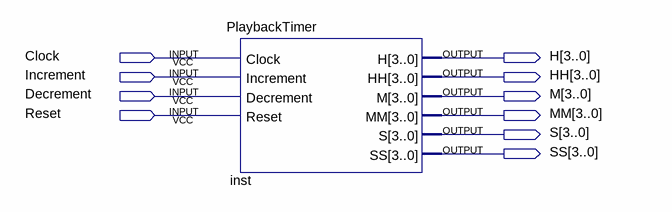
[diagram p0: schematic sheet]
// Quartus schematic partAtest.bdf as structural Verilog: 1 symbols, 10 pins
module partAtest (
  input  Clock,
  input  Increment,
  input  Decrement,
  input  Reset,
  output [3:0] H,
  output [3:0] HH,
  output [3:0] M,
  output [3:0] MM,
  output [3:0] S,
  output [3:0] SS
);

  PlaybackTimer inst (
    .Clock(Clock), .Increment(Increment), .Decrement(Decrement), .Reset(Reset), .H(H), .HH(HH), .M(M),
    .MM(MM), .S(S), .SS(SS));
endmodule
